# Altium schematic sheet CONNECTOR.SchDoc
size A4
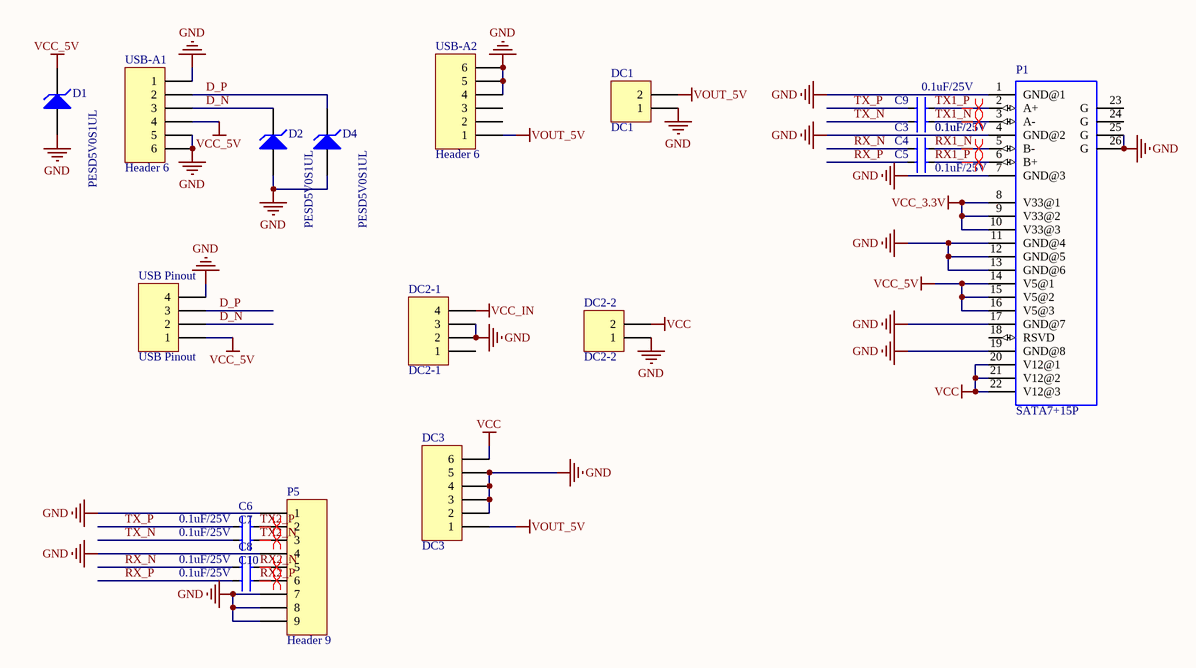
[diagram p0: CONNECTOR.SchDoc]

## Parts
C3  0.1uF/25V  [0603C]
C4  0.1uF/25V  [0603C]
C5  0.1uF/25V  [0603C]
C6  0.1uF/25V  [0603C]
C7  0.1uF/25V  [0603C]
C8  0.1uF/25V  [0603C]
C9  0.1uF/25V  [0603C]
C10  0.1uF/25V  [0603C]
D1  PESD5V0S1UL  [0402R]
D2  PESD5V0S1UL  [0402R]
D4  PESD5V0S1UL  [0402R]
DC1  DC1  [2X2MMZ]
DC2-1  DC2-1  [DC005]
DC2-2  DC2-2  [2X2MMZ]
DC3  DC3  [2X6MMZ]
P1  SATA7+15P  [SATA 7+15PML]
P5  Header 9  [SATA 7P]
USB-A1  Header 6  [USB-A-C]
USB-A2  Header 6  [USB-A-C]
USB_Pinout  USB Pinout  [sip-4l]

## Nets
GND: D1.1(A) D2.1(A) D4.1(A) DC1.1 DC2-1.2 DC2-1.3 DC2-2.1 DC3.2 DC3.3 DC3.4 DC3.5 P1.1(GND@1) P1.4(GND@2) P1.7(GND@3) P1.11(GND@4) P1.12(GND@5) P1.13(GND@6) P1.17(GND@7) P1.19(GND@8) P1.25(G) P1.26(G) P5.1 P5.4 P5.7 P5.8 P5.9 USB-A1.1 USB-A1.5 USB-A1.6 USB-A2.4 USB-A2.5 USB-A2.6 USB_Pinout.4
VCC: DC2-2.2 DC3.6 P1.20(V12@1) P1.21(V12@2) P1.22(V12@3)
VCC_3.3V: P1.8(V33@1) P1.9(V33@2) P1.10(V33@3)
VCC_5V: D1.2(K) P1.14(V5@1) P1.15(V5@2) P1.16(V5@3) USB-A1.4 USB_Pinout.1
VCC_IN: DC2-1.4
VOUT_5V: DC1.2 DC3.1 USB-A2.1
D_N: D2.2(K) USB-A1.3 USB_Pinout.2
D_P: D4.2(K) USB-A1.2 USB_Pinout.3
RX1_N: C4.2 P1.5(B-)
RX1_P: C5.2 P1.6(B+)
RX2_N: C8.2 P5.5
RX2_P: C10.2 P5.6
RX_N: C4.1 C8.1
RX_P: C5.1 C10.1
TX1_N: C3.2 P1.3(A-)
TX1_P: C9.2 P1.2(A+)
TX2_N: C7.2 P5.3
TX2_P: C6.2 P5.2
TX_N: C3.1 C7.1
TX_P: C6.1 C9.1

Not connected (* = marked no-connect by the designer): DC2-1 1; P1 18(RSVD) 23(G) 24(G); USB-A2 2 3

## Layout directives
differential pair: RX1_N, RX1_P, RX2_N, RX2_P, TX1_N, TX1_P, TX2_N, TX2_P

## Library data of the parts
C3-C10 = 0.01UF: CCX85-103
D1 D2 D4 = D Zener: Zener Diode; Published: 8-Jun-2000; LatestRevisionDate: 17-Jul-2002; LatestRevisionNote: Re-released for DXP Platform.; PackageReference: DIODE-0.7; Publisher: Altium Limited
DC1 DC2-2 = Header 2: Header, 2-Pin; LatestRevisionDate: 17-Jul-2002; LatestRevisionNote: Re-released for DXP Platform.; Publisher: Altium Limited
DC2-1 USB_Pinout = Header 4: Header, 4-Pin; LatestRevisionDate: 17-Jul-2002; LatestRevisionNote: Re-released for DXP Platform.; Publisher: Altium Limited
DC3 USB-A1 USB-A2 = Header 6: Header, 6-Pin; LatestRevisionDate: 17-Jul-2002; LatestRevisionNote: Re-released for DXP Platform.; Publisher: Altium Limited
P1 = SATA7+15P: Conn SATA PL 15Power/7Signal POS 1.27mm Solder RA Thru-Hole 22 Terminal 1 Port; MF: 3M; MP: 5622-4100-ML; Price: 2.05 USD; Package: None; SnapEDA_Link: https://www.snapeda.com/parts/5622-4100-ML/3M%2520Purification/view-part/?ref=snap; Availability: Good; Value: *
P5 = Header 9: Header, 9-Pin; LatestRevisionDate: 17-Jul-2002; LatestRevisionNote: Re-released for DXP Platform.; Publisher: Altium Limited